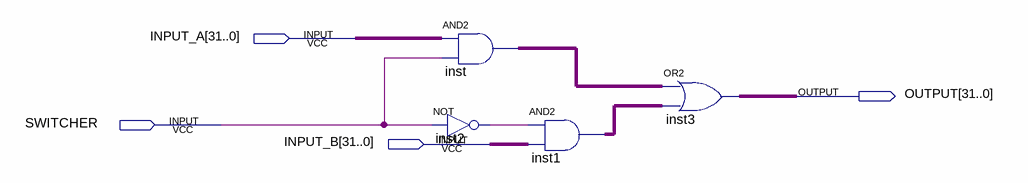
[diagram p0: schematic sheet]
// Quartus schematic Mux32.bdf as structural Verilog: 4 symbols, 4 pins
module Mux32 (
  input  [31:0] INPUT_A,
  input  SWITCHER,
  input  [31:0] INPUT_B,
  output [31:0] OUTPUT
);

  wire inst2_out;
  wire [31:0] inst1_out, inst_out;

  assign inst_out = INPUT_A & {32{SWITCHER}};  // AND2 inst, 32 bits wide
  not inst2 (inst2_out, SWITCHER);
  assign inst1_out = {32{inst2_out}} & INPUT_B;  // AND2 inst1, 32 bits wide
  assign OUTPUT = inst_out | inst1_out;  // OR2 inst3, 32 bits wide
endmodule
